# Altium project PA_2.PrjPcb
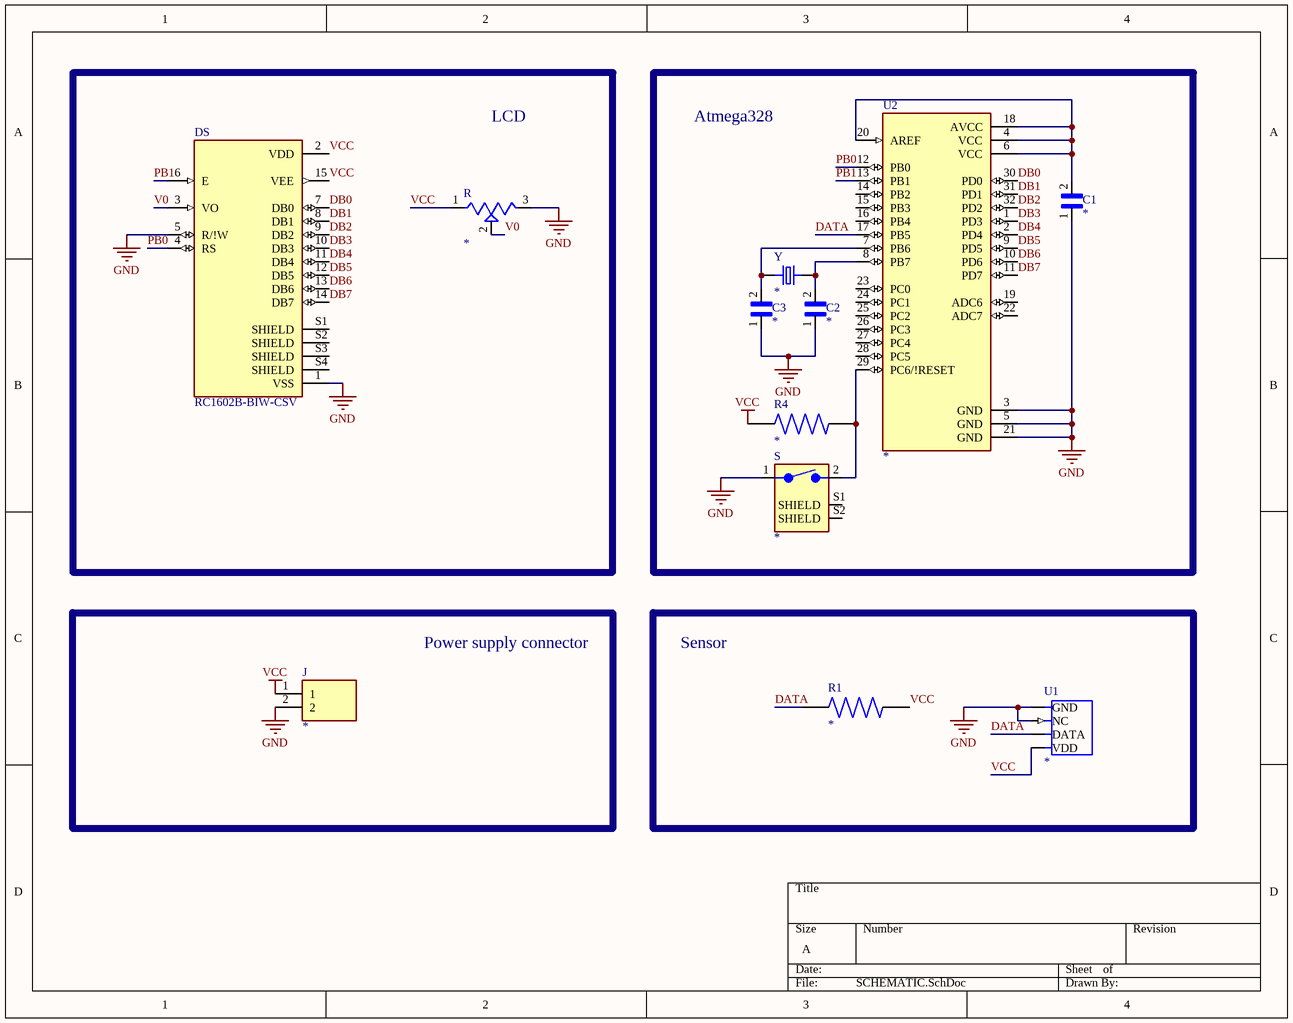
[diagram p0: SCHEMATIC.SchDoc]
2 sheets, 12 parts. Net scope: global (net labels, ports and power ports of the same name join across sheets).
Board files: AT long bus (13.3 x 4.2 inches).PCBDOC, PCB1.PcbDoc
Sheets:
  AT long bus (13.3 x 4.2 inches).schdoc
  SCHEMATIC.SchDoc

## Sheet AT long bus (13.3 x 4.2 inches).schdoc: AT long bus (13.3 x 4.2 inches)
size A; Organization: Organization; Address1: Address1; Address2: Address2; Address3: Address3; Address4: Address4; DocumentNumber: 1; Revision: 0; SheetNumber: 2; SheetTotal: 2

## Sheet SCHEMATIC.SchDoc
size A

### Parts
C1  *  [CAPC1414X145N]
C2  *  [CAPC1414X145N]
C3  *  [CAPC1414X145N]
DS  RC1602B-BIW-CSV  [LCD_RC1602B-BIW-CSV]
J  *  [MOLEX_0039296028]
R  *  [TRIM_3296W-1-20K]
R1  *  [RESC1608X55N]
R4  *  [RESC1608X55N]
S  1-1825027-1  [SW_1-1825027-1]  (value not drawn)
U1  *  [SNR4-2.54-25.0X15.0X7.0MM]
U2  *  [QFP80P900X900X120-32N]
Y  *  [XTAL_ECS-180-S-5P-DN-TR]

### Blocks framed on the sheet
LCD: DS R
Atmega328: C1-C3 R4 S U2 Y
Power supply connector: J
Sensor: R1 U1

### Nets
GND: C1.1 C2.1 C3.1 DS.1(VSS) DS.5(R/!W) J.2 R.3(CW) S.1 U1.P$3(NC) U1.P$4(GND) U2.3(GND) U2.5(GND) U2.21(GND)
VCC: DS.2(VDD) DS.15(VEE) J.1 R.1(CCW) R1.2 R4.1 U1.P$1(VDD)
DATA: R1.1 U1.P$2(DATA) U2.17(PB5)
DB0: DS.7(DB0) U2.30(PD0)
DB1: DS.8(DB1) U2.31(PD1)
DB2: DS.9(DB2) U2.32(PD2)
DB3: DS.10(DB3) U2.1(PD3)
DB4: DS.11(DB4) U2.2(PD4)
DB5: DS.12(DB5) U2.9(PD5)
DB6: DS.13(DB6) U2.10(PD6)
DB7: DS.14(DB7) U2.11(PD7)
PB0: DS.4(RS) U2.12(PB0)
PB1: DS.6(E) U2.13(PB1)
V0: DS.3(VO) R.2(WIPER)
NetC1_2: C1.2 U2.4(VCC) U2.6(VCC) U2.18(AVCC) U2.20(AREF)
NetC2_2: C2.2 U2.8(PB7) Y.2
NetC3_2: C3.2 U2.7(PB6) Y.1
NetR4_2: R4.2 S.2 U2.29(PC6/!RESET)

Not connected (* = marked no-connect by the designer): DS S1(SHIELD) S2(SHIELD) S3(SHIELD) S4(SHIELD); S S1(SHIELD) S2(SHIELD); U2 14(PB2) 15(PB3) 16(PB4) 19(ADC6) 22(ADC7) 23(PC0) 24(PC1) 25(PC2) 26(PC3) 27(PC4) 28(PC5)

### Library data of the parts
C1-C3 = SQCAEM200JATWE: CAP CER 20PF 150V 0505; MF: AVX; Package: 1414 AVX; Value: *; Availability: Unavailable; MP: SQCAEM200JATWE; Price: None; SnapEDA_Link: https://www.snapeda.com/parts/SQCAEM200JATWE/AVX/view-part/1673362/?ref=snap
DS = RC1602B-BIW-CSV: Display: LCD; alphanumeric; STN Negative; 16x2; blue; LED; PIN: 16; MF: Raystar; Price: None; Package: None; Value: *; MP: RC1602B-BIW-CSV; Availability: Unavailable; SnapEDA_Link: https://www.snapeda.com/parts/RC1602B-BIW-CSV/Raystar/view-part/581171/?ref=snap
J = 0039296028: Connector Header Through Hole 2 position; MF: Molex; Price: None; SnapEDA_Link: https://www.snapeda.com/parts/0039296028/Molex/view-part/2751623/?ref=snap; Package: None; Availability: Unavailable; MP: 0039296028; Value: *
R = 3296W-1-20K: Res Trimmer 20K Ohm 10% 1/2W 25Turn 2.19mm Pin Thru-Hole Tube; MF: Bourns; Package: None; Value: *; Availability: Unavailable; MP: 3296W-1-20K; Price: None; SnapEDA_Link: https://www.snapeda.com/parts/3296W-1-20K/Bourns/view-part/459266/?ref=snap
R1 R4 = CSR0603JT27L0: RES 0.027 OHM 5% 1/8W 0603; MF: Stackpole Electronics Inc; SnapEDA_Link: https://www.snapeda.com/parts/CSR0603JT27L0/Stackpole%20Electronics%20Inc/view-part/3958255/?ref=snap; Availability: Unavailable; Price: None; MP: CSR0603JT27L0; Package: 1608 Rohm Semiconductor; Value: *
S = 1-1825027-1: Switch Push Button OFF _ON_ SPST Round Button 0.05A 24VDC Momentary Contact PC Pins Thru-Hole; MF: TE Connectivity; Package: None; EU_RoHS_Compliance: Compliant; Price: None; TE_purchase_URL: https://www.te.com/usa-en/product-1-1825027-1.html?te_bu=Cor&te_type=disp&te_campaign=seda_glo_cor-seda-global-disp-prtnr-fy19-seda-model-bom-cta_sma-317_1&elqCampaignId=32493; SnapEDA_Link: https://www.snapeda.com/parts/1-1825027-1/TE%20Connectivity%20ALCOSWITCH%20Switches/view-part/394875/?ref=snap; Availability: Unavailable; Value: *; MP: 1-1825027-1; Comment_1: *
U1 = TEM-HUM-AM2302(4P-25.0X15.0MM): AM2302/DHT22 Humidity, Temperature Sensor mikroBUSâ„¢ Clickâ„¢ Platform Evaluation Expansion Board; MF: Seeed Technology; MP: AM2302; Value: *; Package: Housed Sensor Seeed Technology; Price: None; Availability: Unavailable; SnapEDA_Link: https://www.snapeda.com/parts/AM2302/Seeed%20Technology%20Co.%2C%20Ltd/view-part/1087537/?ref=snap
U2 = ATMEGA328-AU: AVR AVRÂ® ATmega Microcontroller IC 8-Bit 20MHz 32KB _16K x 16_ FLASH 32-TQFP _7x7_; MF: Microchip; Price: None; Package: TQFP-32 Microchip; Value: *; MP: ATMEGA328-AU; Availability: Unavailable; SnapEDA_Link: https://www.snapeda.com/parts/ATMEGA328-AU/Microchip/view-part/1227240/?ref=snap
Y = ECS-180-S-5P-DN-TR: Crystals 18MHz; MF: ECS International; MP: ECS-180-S-5P-DN-TR; Value: *; SnapEDA_Link: https://www.snapeda.com/parts/ECS-180-S-5P-DN-TR/ECS%20International/view-part/2547669/?ref=snap; Price: None; Package: HC49/US ECS International; Availability: Unavailable